# Altium schematic sheet dv_power_chanel_ВП.SchDoc: =GlobalProjectName
size 410 x 297 mm; ApprovedBy: Утвердил; CheckedBy: Проверил; Author: Разработал; SheetNumber: 2; SheetTotal: 2; PageSetup: Record=PageOptions|CenterHorizontal=True|CenterVertical=True|PrintScale=1.00|XCorrection=1.00|YCorrection=1.00|PrintKind=1|BorderSize=5000000|LeftOffset=0|BottomOffset=0|Orientation=2|PaperLength=1000|PaperWidth=1000|Scale=100|PaperSource=15|PrintQuality=1200|MediaType=1|DitherType=10|PaperKind=A3|PrintScaleMode=1; Weight: -; ScaleFactor: -; NormInspection: Норм.Контр.; Time: Листов
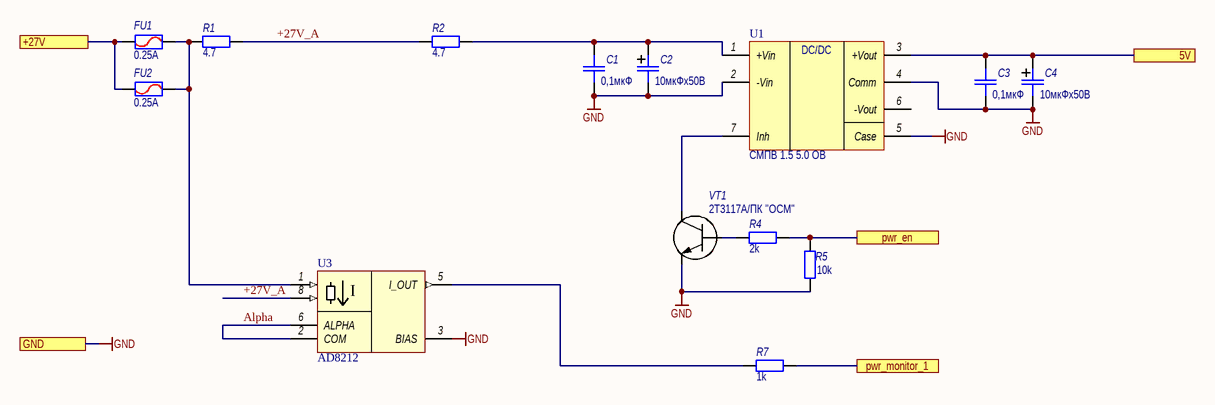
[diagram p0: dv_power_chanel_ВП.SchDoc]

## Parts
C1  0,1мкФ  [SMD_0805]
C2  10мкФх50В  [SMD_size_B]
C3  0,1мкФ  [SMD_0805]
C4  10мкФх50В  [SMD_size_B]
FU1  value 0.25A  [VP1-2]  (hidden comment: VP1-2)
FU2  value 0.25A  [VP1-2]  (hidden comment: VP1-2)
R1  4.7  [SMD_0805]
R2  4.7  [SMD_0805]
R4  2k  [SMD_0805]
R5  10k  [SMD_0805]
R7  1k  [SMD_0805]
U1  SLH28xx  [SLH28xx]  (value not drawn)
U3  AD8212  [MSOP-8]
VT1  Наименование: 2Т3117А/ПК "ОСМ"  [TO-18]  (hidden comment: 2T3117A)

## Ports
5V, +27V, GND, pwr_en, pwr_monitor_1

## Nets
GND: C1.1 C2.2 C3.1 C4.2 R5.1 U1.2(-Vin) U1.4(Comm) U1.5(Case) U3.3(BIAS) VT1.1(EMITTER) ; port GND
5V: C3.2 C4.1 U1.3(+Vout) ; port 5V
+27V: FU1.1 FU2.1 ; port +27V
+27V_A: R1.1 R2.2 U3.8(V_SENSE)
Alpha: U3.2(COM) U3.6(ALPHA)
pwr_en: R4.2 R5.2 ; port pwr_en
pwr_monitor_1: R7.2 ; port pwr_monitor_1
NetC1_2: C1.2 C2.1 R2.1 U1.1(+Vin)
NetFU1_2: FU1.2 FU2.2 R1.2 U3.1(V+)
NetR4_1: R4.1 VT1.2(BASE)
NetR7_1: R7.1 U3.5(I_OUT)
NetU1_7: U1.7(Inh) VT1.3(COLLECTOR)

Not connected (* = marked no-connect by the designer): U1 6(-Vout)

## Notes on the sheet
- Подп. и дата
- Инв. № дубл.
- Взам. инв. №
- Инв. № подл.
- Изм.
- Лист
- № докум.
- Подп.
- Дата
- Форма 2а ГОСТ 2.104-2006
- Копировал
- Формат А3
- (in symbol AD8212) I
- (in symbol SLH28xx) DC/DC; СМПВ 1.5 5.0 ОВ

## Library data of the parts
C1 C3 = Capacitor: Назначение: SMD-конденсатор; Наименование: Конденсатор; Потребление, Вт: 0; Value: 0,1мкФ
C2 C4 = Capacitor_pol: Polarized capacitor; Назначение: Поляризованный SMD-конденсатор; Наименование: Поляризованный конденсатор; Потребление, Вт: 0; Value: 10мкФх50В
FU1 FU2 = VP1-2: Предохранитель плавкий; Наименование: ВП1-2 "ВП"; Назначение: Предохранитель плавкий; ComponentLink1Description: DataSheet; ComponentLink1URL: https://docviewer.yandex.ru/view/20572601/?page=1&*=oYyHA%2BCwzeyRvrmOJV6%2ByaBlbHJ7InVybCI6Imh0dHBzOi8vZWwtcmEucnUvdXBsb2FkL2libG9jay8wMTYvdnN0YXZrYS1wbGF2a2EtdnAxXzItX2VsZWt0cm9uaWthX3JhXy5wZGYiLCJ0aXRsZSI6InZzdGF2a2EtcGxhdmthLXZwMV8yLV9lbGVrdHJvbmlrYV9yYV8ucGRmIiwibm9pZnJhbWUiOnRydWUsInVpZCI6IjIwNTcyNjAxIiwidHMiOjE1OTI0NzI0NTM1MTUsInl1IjoiODg5MDYxMzMxNTQzMzg3MTIxIiwic2VycFBhcmFtcyI6Imxhbmc9cnUmdG09MTU5MjQ3MjQyOCZ0bGQ9cnUmbmFtZT12c3RhdmthLXBsYXZrYS12cDFfMi1fZWxla3Ryb25pa2FfcmFfLnBkZiZ0ZXh0PSVEMCVCMiVEMCVCRjEtMiZ1cmw9aHR0cHMlM0EvL2VsLXJhLnJ1L3VwbG9hZC9pYmxvY2svMDE2L3ZzdGF2a2EtcGxhdmthLXZwMV8yLV9lbGVrdHJvbmlrYV9yYV8ucGRmJmxyPTY1Jm1pbWU9cGRmJmwxMG49cnUmc2lnbj0yZWMwNDRiZDQyMGRlMjRmMjI1MThkNTc4YjZlMTlkYiZrZXlubz0wIn0%3D&lang=ru
R1 R2 R4 R5 R7 = Resistor: Наименование: Резистор; Назначение: SMD-резистор; Потребление, Вт: 0,001
  R1 R2: Value: 4.7
  R4: Value: 2k
  R5: Value: 10k
  R7: Value: 1k
U1 = SLH28xx: DC-DC; Назначение: DC-DC преобразователь; Потребление, Вт: 0.1; ComponentLink1Description: DataSheet; ComponentLink1URL: https://www.interpoint.com/product_documents/SLH_Space_DC_DC_Converters.pdf
U3 = AD8212: Current shunt monitor; Назначение: Токовый датчик; Потребление, Вт: 0,005; Наименование: AD8212; ComponentLink1Description: DataSheet; ComponentLink1URL: https://www.analog.com/media/en/technical-documentation/data-sheets/AD8212.pdf
VT1 = 2T3117A: Кремниевый биполярный / эпитаксиально-планарный / n-p-n транзистор; Назначение: Биполярный транзистор; Потребление, Вт: 0,0; ComponentLink1Description: DataSheet; ComponentLink1URL: https://www.integral.by/sites/default/files/pdf/2t3117.pdf